# Altium schematic sheet GSM GNSS Module.SchDoc
size 209 x 297 mm; Author: Мурашкин Д.В.; Address1: Address1; Address2: Address2; Address3: Address3; Address4: Address4; DocumentNumber: АБВГ.123456.001 Э3; Scale: 1:1; Letter1Column: Э; PartName: GSM/GNSS Модуль; DocumentName: 2
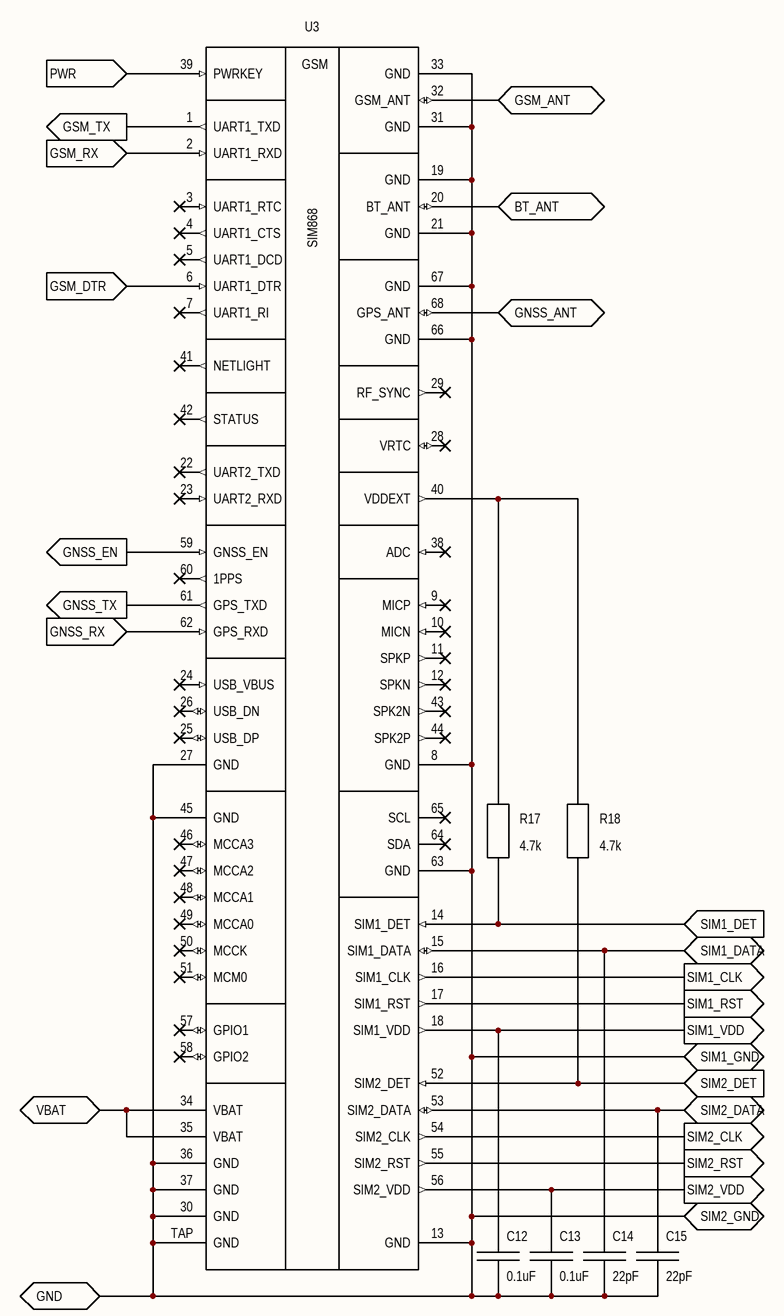
[diagram p0: GSM GNSS Module.SchDoc]

## Parts
C12  0.1uF  [CAPC1608L]
C13  0.1uF  [CAPC1608L]
C14  22pF  [CAPC1608L]
C15  22pF  [CAPC1608L]
R17  4.7k  [RESC1608L]
R18  4.7k  [RESC1608L]
U3  SIM868  [SIM868]

## Ports
BT_ANT, GND, GNSS_ANT, GNSS_EN (out), GNSS_RX (in), GNSS_TX (out), GSM_ANT, GSM_DTR (in), GSM_RX (in), GSM_TX (out), PWR (in), SIM1_CLK (out), SIM1_DATA (bidir), SIM1_DET (in), SIM1_GND, SIM1_RST (out), SIM1_VDD (out), SIM2_CLK (out), SIM2_DATA (bidir), SIM2_DET (in), SIM2_GND, SIM2_RST (out), SIM2_VDD (out), VBAT

## Nets
BT_ANT: U3.20(BT_ANT) ; port BT_ANT
GND: C12.2 C13.2 C14.2 C15.2 U3.8(GND) U3.13(GND) U3.19(GND) U3.21(GND) U3.27(GND) U3.30(GND) U3.31(GND) U3.33(GND) U3.36(GND) U3.37(GND) U3.45(GND) U3.63(GND) U3.66(GND) U3.67(GND) U3.TAP(GND) ; port SIM1_GND, port GND, port SIM2_GND
GNSS_ANT: U3.68(GPS_ANT) ; port GNSS_ANT
GNSS_EN: U3.59(GNSS_EN) ; port GNSS_EN
GNSS_RX: U3.62(GPS_RXD) ; port GNSS_RX
GNSS_TX: U3.61(GPS_TXD) ; port GNSS_TX
GSM_ANT: U3.32(GSM_ANT) ; port GSM_ANT
GSM_DTR: U3.6(UART1_DTR) ; port GSM_DTR
GSM_RX: U3.2(UART1_RXD) ; port GSM_RX
GSM_TX: U3.1(UART1_TXD) ; port GSM_TX
PWR: U3.39(PWRKEY) ; port PWR
SIM1_CLK: U3.16(SIM1_CLK) ; port SIM1_CLK
SIM1_DATA: C14.1 U3.15(SIM1_DATA) ; port SIM1_DATA
SIM1_DET: R17.2 U3.14(SIM1_DET) ; port SIM1_DET
SIM1_RST: U3.17(SIM1_RST) ; port SIM1_RST
SIM1_VDD: C12.1 U3.18(SIM1_VDD) ; port SIM1_VDD
SIM2_CLK: U3.54(SIM2_CLK) ; port SIM2_CLK
SIM2_DATA: C15.1 U3.53(SIM2_DATA) ; port SIM2_DATA
SIM2_DET: R18.2 U3.52(SIM2_DET) ; port SIM2_DET
SIM2_RST: U3.55(SIM2_RST) ; port SIM2_RST
SIM2_VDD: C13.1 U3.56(SIM2_VDD) ; port SIM2_VDD
VBAT: U3.34(VBAT) U3.35(VBAT) ; port VBAT
NetR17_1: R17.1 R18.1 U3.40(VDDEXT)

Not connected (* = marked no-connect by the designer): U3 3(UART1_RTC)* 4(UART1_CTS)* 5(UART1_DCD)* 7(UART1_RI)* 9(MICP)* 10(MICN)* 11(SPKP)* 12(SPKN)* 22(UART2_TXD)* 23(UART2_RXD)* 24(USB_VBUS)* 25(USB_DP)* 26(USB_DN)* 28(VRTC)* 29(RF_SYNC)* 38(ADC)* 41(NETLIGHT)* 42(STATUS)* 43(SPK2N)* 44(SPK2P)* 46(MCCA3)* 47(MCCA2)* 48(MCCA1)* 49(MCCA0)* 50(MCCK)* 51(MCM0)* 57(GPIO1)* 58(GPIO2)* 60(1PPS)* 64(SDA)* 65(SCL)*

## Notes on the sheet
- Перв. примен.
- Справ. №
- Подп. и дата
- Инв. № дубл.
- Взам. инв. №
- Инв. № подл.
- Изм.
- Лист
- № докум.
- Подп.
- Дата
- 2.106-A4
- Копировал
- Формат А4
- (in symbol SIM868) GSM

## Library data of the parts
C12 C13 = CC0603KRX7R8BB104: Capacitor Ceramic 0.1uF 25V 0603(1608); Manufacturer: Yageo; Group: Ceramic Capacitors; Temperature Coefficient: X7R; Tolerance: ±10%; Voltage: 25; Type: Ceramic; Part name: CC0603KRX7R8BB104; Package: 0603 (1608); Value: 0.1uF
C14 C15 = CC0201JRNPO9BN220: Capacitor Ceramic 22pF 50V 0603(1608); Manufacturer: Yageo; Group: Ceramic Capacitors; Temperature Coefficient: C0G; Tolerance: ±5%; Voltage: 50; Type: Ceramic; Part name: CC0201JRNPO9BN220; Package: 0603 (1608); Value: 22pF
R17 R18 = RC0603JR-074K7L: Resistor Ceramic 4.7k 0.1W 0603(1608); Manufacturer: Yageo; Group: Resistors; Temperature Coefficient: ±100ppm/°C; Tolerance: ±5%; Part name: RC0603JR-074K7L; Type: Thin Film; Power: 0.1W; Package: 0603 (1608); Value: 4.7k
U3 = SIM868: GSM/GPRS/GNSS module; Manufacturer: SIMCOM; Group: Wireless; Package: SIM868; Part name: SIM868